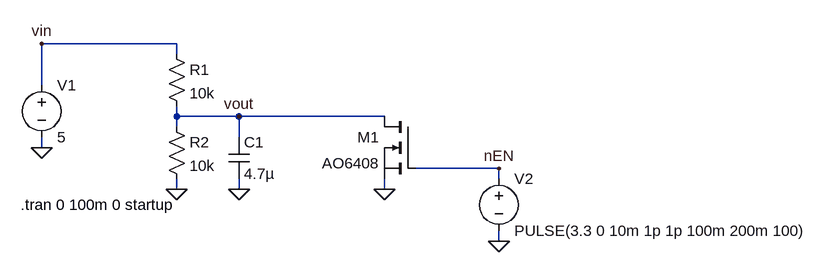
[diagram p0: schematic soft_start.asc]
soft_start.asc, the LTspice schematic file:
Version 4.1
SHEET 1 1240 680
WIRE 224 80 16 80
WIRE 224 96 224 80
WIRE 16 144 16 80
WIRE 224 192 224 176
WIRE 320 192 224 192
WIRE 544 192 320 192
WIRE 224 208 224 192
WIRE 320 224 320 192
WIRE 16 240 16 224
WIRE 720 272 592 272
WIRE 720 288 720 272
WIRE 224 304 224 288
WIRE 320 304 320 288
WIRE 544 304 544 288
WIRE 720 384 720 368
FLAG 224 304 0
FLAG 320 304 0
FLAG 16 240 0
FLAG 16 80 vin
FLAG 320 192 vout
FLAG 720 384 0
FLAG 544 304 0
FLAG 720 272 nEN
SYMBOL voltage 16 128 R0
WINDOW 123 0 0 Left 0
WINDOW 39 0 0 Left 0
SYMATTR InstName V1
SYMATTR Value 5
SYMBOL res 208 80 R0
SYMATTR InstName R1
SYMATTR Value 10k
SYMBOL res 208 192 R0
SYMATTR InstName R2
SYMATTR Value 10k
SYMBOL cap 304 224 R0
SYMATTR InstName C1
SYMATTR Value 4.7µ
SYMBOL voltage 720 272 R0
WINDOW 123 0 0 Left 0
WINDOW 39 0 0 Left 0
SYMATTR InstName V2
SYMATTR Value PULSE(3.3 0 10m 1p 1p 100m 200m 100)
SYMBOL nmos 592 192 M0
SYMATTR InstName M1
SYMATTR Value AO6408
TEXT -16 328 Left 2 !.tran 0 100m 0 startup

The netlist it stands for:
* soft_start.asc
V1 vin 0 5
R1 vin vout 10k
R2 vout 0 10k
C1 vout 0 4.7µ
V2 nEN 0 PULSE(3.3 0 10m 1p 1p 100m 200m 100)
M1 vout nEN 0 0 AO6408
.model NMOS NMOS
.model PMOS PMOS
.lib standard.mos
.tran 0 100m 0 startup
.backanno
.end